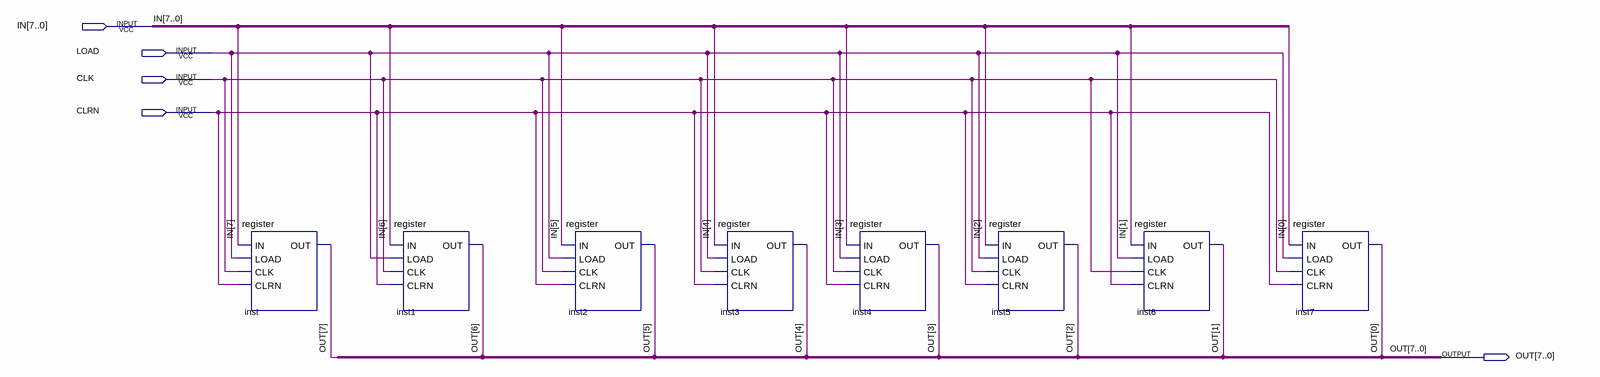
[diagram p0: schematic sheet]
// Quartus schematic 8bit_register.bdf as structural Verilog: 8 symbols, 5 pins
module \8bit_register  (
  input  [7:0] IN,
  input  LOAD,
  input  CLK,
  input  CLRN,
  output [7:0] OUT
);

  register inst (.IN(IN[7]), .LOAD(LOAD), .CLK(CLK), .CLRN(CLRN), .OUT(OUT[7]));
  register inst1 (.IN(IN[6]), .LOAD(LOAD), .CLK(CLK), .CLRN(CLRN), .OUT(OUT[6]));
  register inst2 (.IN(IN[5]), .LOAD(LOAD), .CLK(CLK), .CLRN(CLRN), .OUT(OUT[5]));
  register inst3 (.IN(IN[4]), .LOAD(LOAD), .CLK(CLK), .CLRN(CLRN), .OUT(OUT[4]));
  register inst4 (.IN(IN[3]), .LOAD(LOAD), .CLK(CLK), .CLRN(CLRN), .OUT(OUT[3]));
  register inst5 (.IN(IN[2]), .LOAD(LOAD), .CLK(CLK), .CLRN(CLRN), .OUT(OUT[2]));
  register inst6 (.IN(IN[1]), .LOAD(LOAD), .CLK(CLK), .CLRN(CLRN), .OUT(OUT[1]));
  register inst7 (.IN(IN[0]), .LOAD(LOAD), .CLK(CLK), .CLRN(CLRN), .OUT(OUT[0]));
endmodule
